# Altium schematic sheet etapa1_anger_Y.SchDoc
size A4
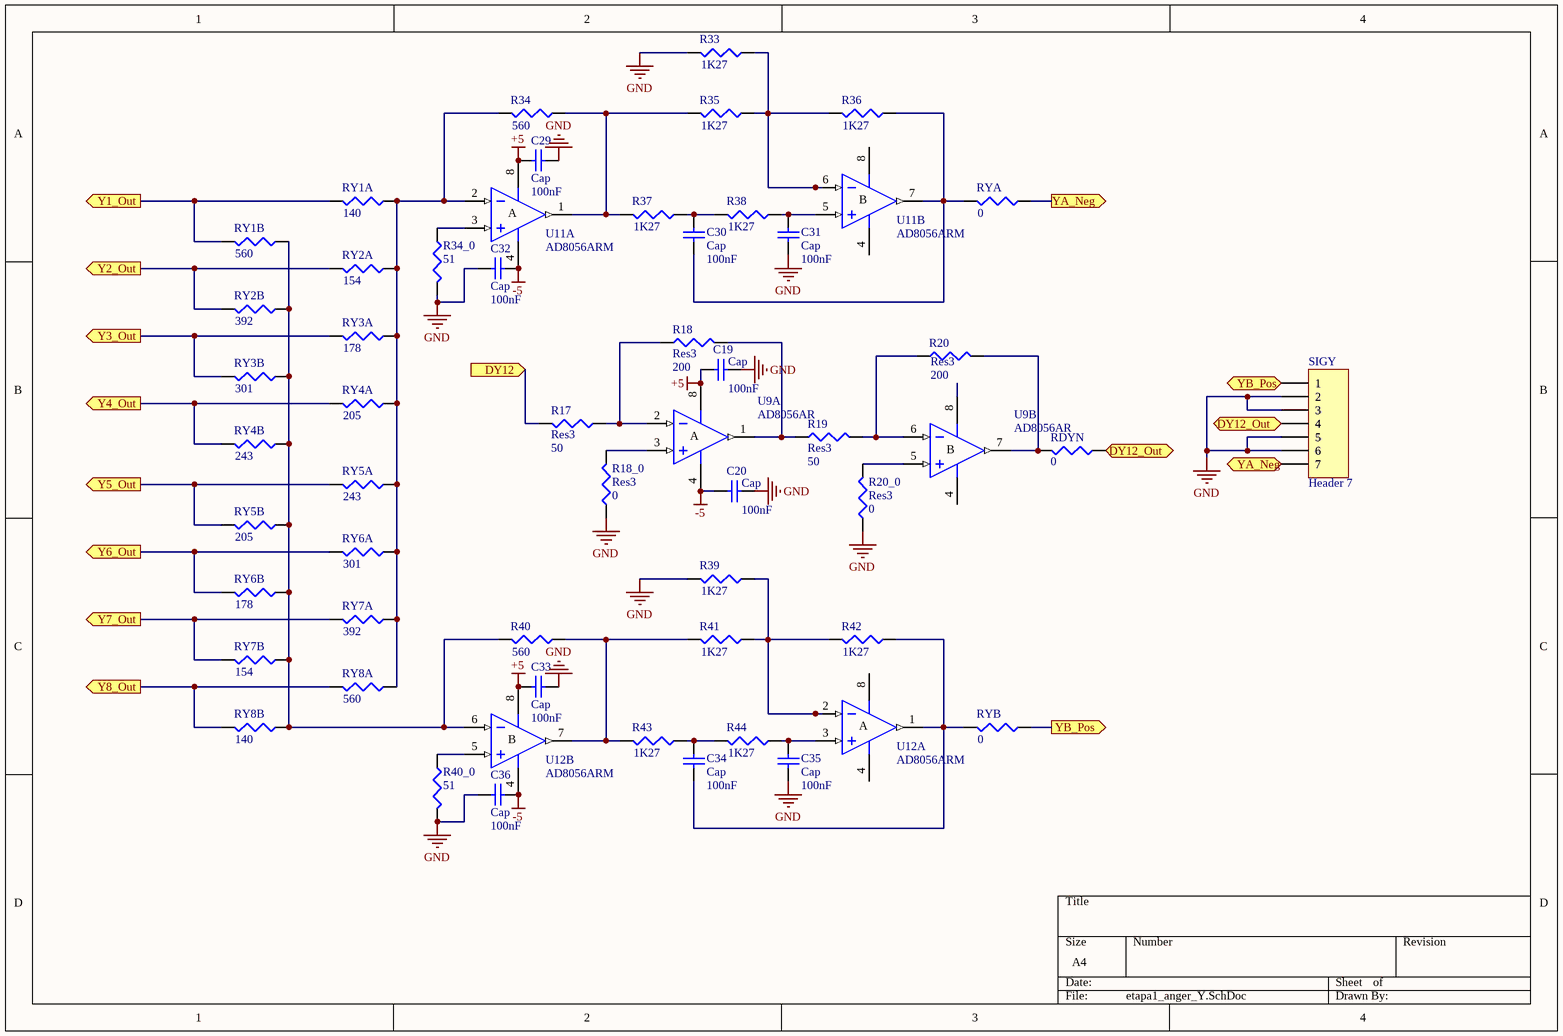
[diagram p0: etapa1_anger_Y.SchDoc]

## Parts
C19  Cap  value 100nF  [1608[0603]]
C20  Cap  value 100nF  [1608[0603]]
C29  Cap  value 100nF  [1608[0603]]
C30  Cap  value 100nF  [1608[0603]]
C31  Cap  value 100nF  [1608[0603]]
C32  Cap  value 100nF  [1608[0603]]
C33  Cap  value 100nF  [1608[0603]]
C34  Cap  value 100nF  [1608[0603]]
C35  Cap  value 100nF  [1608[0603]]
C36  Cap  value 100nF  [1608[0603]]
R17  Res3  value 50  [0402]
R18  Res3  value 200  [0402]
R18_0  Res3  value 0  [0402]
R19  Res3  value 50  [0402]
R20  Res3  value 200  [0402]
R20_0  Res3  value 0  [0402]
R33  value 1K27  [1608[0603]]  (hidden comment: Res3)
R34  value 560  [0402]  (hidden comment: Res3)
R34_0  value 51  [0402]  (hidden comment: Res3)
R35  value 1K27  [0402]  (hidden comment: Res3)
R36  value 1K27  [0402]  (hidden comment: Res3)
R37  value 1K27  [0402]  (hidden comment: Res3)
R38  value 1K27  [0402]  (hidden comment: Res3)
R39  value 1K27  [1608[0603]]  (hidden comment: Res3)
R40  value 560  [0402]  (hidden comment: Res3)
R40_0  value 51  [0402]  (hidden comment: Res3)
R41  value 1K27  [0402]  (hidden comment: Res3)
R42  value 1K27  [0402]  (hidden comment: Res3)
R43  value 1K27  [0402]  (hidden comment: Res3)
R44  value 1K27  [0402]  (hidden comment: Res3)
RDYN  value 0  [0402]  (hidden comment: Res3)
RY1A  value 140  [0402]  (hidden comment: Res3)
RY1B  value 560  [0402]  (hidden comment: Res3)
RY2A  value 154  [0402]  (hidden comment: Res3)
RY2B  value 392  [0402]  (hidden comment: Res3)
RY3A  value 178  [0402]  (hidden comment: Res3)
RY3B  value 301  [0402]  (hidden comment: Res3)
RY4A  value 205  [0402]  (hidden comment: Res3)
RY4B  value 243  [0402]  (hidden comment: Res3)
RY5A  value 243  [0402]  (hidden comment: Res3)
RY5B  value 205  [0402]  (hidden comment: Res3)
RY6A  value 301  [0402]  (hidden comment: Res3)
RY6B  value 178  [0402]  (hidden comment: Res3)
RY7A  value 392  [0402]  (hidden comment: Res3)
RY7B  value 154  [0402]  (hidden comment: Res3)
RY8A  value 560  [0402]  (hidden comment: Res3)
RY8B  value 140  [0402]  (hidden comment: Res3)
RYA  value 0  [0402]  (hidden comment: Res3)
RYB  value 0  [0402]  (hidden comment: Res3)
SIGY  Header 7  [HDR1X7]
U9  AD8056AR  [RM-8]  (parts A,B of 2)
U11  AD8056ARM  [RM-8]  (parts A,B of 2)
U12  AD8056ARM  [RM-8]  (parts A,B of 2)

## Ports
DY12 (in), DY12_Out (out), Y1_Out (out), Y2_Out (out), Y3_Out (out), Y4_Out (out), Y5_Out (out), Y6_Out (out), Y7_Out (out), Y8_Out (out), YA_Neg (out), YB_Pos (out)

## Nets
+5: C19.2 C29.1 C33.1 U9.8(V+) U11.8(V+) U12.8(V+)
-5: C20.2 C32.2 C36.2 U9.4(V-) U11.4(V-) U12.4(V-)
GND: C19.1 C20.1 C29.2 C31.2 C32.1 C33.2 C35.2 C36.1 R18_0.1 R20_0.1 R33.2 R34_0.2 R39.2 R40_0.2 SIGY.2 SIGY.3 SIGY.5 SIGY.6
DY12: R17.2 ; port DY12
DY12_Out: RDYN.1 SIGY.4 ; port DY12_Out
Y1_Out: RY1A.2 RY1B.2 ; port Y1_Out
Y2_Out: RY2A.2 RY2B.2 ; port Y2_Out
Y3_Out: RY3A.2 RY3B.2 ; port Y3_Out
Y4_Out: RY4A.2 RY4B.2 ; port Y4_Out
Y5_Out: RY5A.2 RY5B.2 ; port Y5_Out
Y6_Out: RY6A.2 RY6B.2 ; port Y6_Out
Y7_Out: RY7A.2 RY7B.2 ; port Y7_Out
Y8_Out: RY8A.2 RY8B.2 ; port Y8_Out
YA_Neg: RYA.1 SIGY.7 ; port YA_Neg
YB_Pos: RYB.1 SIGY.1 ; port YB_Pos
NetC30_1: C30.1 R37.1 R38.2
NetC30_2: C30.2 R36.1 RYA.2 U11.7(OUT)
NetC31_1: C31.1 R38.1 U11.5(IN+)
NetC34_1: C34.1 R43.1 R44.2
NetC34_2: C34.2 R42.1 RYB.2 U12.1(OUT)
NetC35_1: C35.1 R44.1 U12.3(IN+)
NetR17_1: R17.1 R18.1 U9.2(IN-)
NetR18_0_2: R18_0.2 U9.3(IN+)
NetR18_2: R18.2 R19.1 U9.1(OUT)
NetR19_2: R19.2 R20.1 U9.6(IN-)
NetR20_0_2: R20_0.2 U9.5(IN+)
NetR20_2: R20.2 RDYN.2 U9.7(OUT)
NetR33_1: R33.1 R35.1 R36.2 U11.6(IN-)
NetR34_0_1: R34_0.1 U11.3(IN+)
NetR34_1: R34.1 R35.2 R37.2 U11.1(OUT)
NetR34_2: R34.2 RY1A.1 RY2A.1 RY3A.1 RY4A.1 RY5A.1 RY6A.1 RY7A.1 RY8A.1 U11.2(IN-)
NetR39_1: R39.1 R41.1 R42.2 U12.2(IN-)
NetR40_0_1: R40_0.1 U12.5(IN+)
NetR40_1: R40.1 R41.2 R43.2 U12.7(OUT)
NetR40_2: R40.2 RY1B.1 RY2B.1 RY3B.1 RY4B.1 RY5B.1 RY6B.1 RY7B.1 RY8B.1 U12.6(IN-)

## Notes on the sheet
- (in symbol AD8056AR, part A) A
- (in symbol AD8056AR, part B) B
- (in symbol AD8056ARM, part A) A
- (in symbol AD8056ARM, part B) B

## Library data of the parts
C19 C20 C29-C36 = Cap: Capacitor; Published: 8-Jun-2000; LatestRevisionDate: 17-Jul-2002; LatestRevisionNote: Re-released for DXP Platform.; PackageReference: RAD-0.3; Publisher: Altium Limited; PackageDescription: Radial Cap, Thru-Hole; 2 Leads; 0.3 in Pin Spacing
R17 R18 R18_0 R19 R20 R20_0 R33 R34 R34_0 R35-R40 R40_0 R41-R44 RDYN RY1A RY1B RY2A RY2B RY3A RY3B RY4A RY4B RY5A RY5B RY6A RY6B RY7A RY7B RY8A RY8B RYA RYB = Res3: Resistor; Published: 8-Jun-2000; LatestRevisionDate: 29-May-2009; LatestRevisionNote: IPC-7351 Footprint Added.; PackageReference: J1-0603; Publisher: Altium Limited; PackageDescription: Chip Resistor
SIGY = Header 7: Header, 7-Pin; LatestRevisionDate: 17-Jul-2002; LatestRevisionNote: Re-released for DXP Platform.; Publisher: Altium Limited
U9 = AD8056AR: Low Cost, 300MHz Voltage Feedback Amplifier; Published: 8-Jun-2000; LatestRevisionDate: 13-Apr-2006; LatestRevisionNote: IPC-7351 Footprint Added.; DatasheetVersion: REV. 0 1997; PackageVersion: revA; PackageReference: SO-8; Publisher: Altium Limited; PackageDescription: 8-Pin Small Outline Integrated Circuit 1.27 mm Pitch; Code_JEDEC: MS-012-AA; Code_IPC: SOIC127P600-8; ComponentLink1Description: Manufacturer Link; ComponentLink1URL: http://www.analog.com/en/prod/0,,759_786_AD8055%2C00.html; ComponentLink2Description: Datasheet; ComponentLink2URL: http://www.analog.com/UploadedFiles/Data_Sheets/40402558757264AD8055_6_i.pdf
U11 U12 = AD8056ARM: Low Cost, 300MHz Voltage Feedback Amplifier; Published: 8-Jun-2000; LatestRevisionDate: 04-Mar-2005; LatestRevisionNote: Stylized 3D Model Added, PCB footprint pad width decreased.; DatasheetVersion: REV. 0 1997; PackageVersion: 2004; PackageReference: RM-8; Publisher: Altium Limited; PackageDescription: Shrink Small Outline, MSOP; 8 Leads; Body Width 3 mm; Pitch 0.65 mm; Code_JEDEC: MO-187-AA; ComponentLink1Description: Manufacturer Link; ComponentLink1URL: http://www.analog.com/en/prod/0,,759_786_AD8055%2C00.html; ComponentLink2Description: Datasheet; ComponentLink2URL: http://www.analog.com/UploadedFiles/Data_Sheets/40402558757264AD8055_6_i.pdf